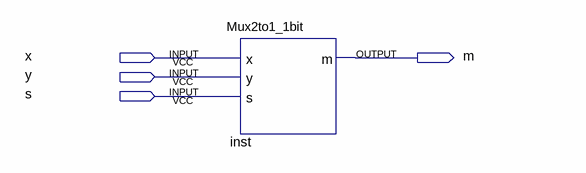
[diagram p0: schematic sheet]
// Quartus schematic Mux.bdf as structural Verilog: 1 symbols, 4 pins
module Mux (
  input  x,
  input  y,
  input  s,
  output m
);

  Mux2to1_1bit inst (.x(x), .y(y), .s(s), .m(m));
endmodule
